# Altium schematic sheet DigitalOut.SchDoc
size A4; SheetNumber: 7; SheetTotal: 8
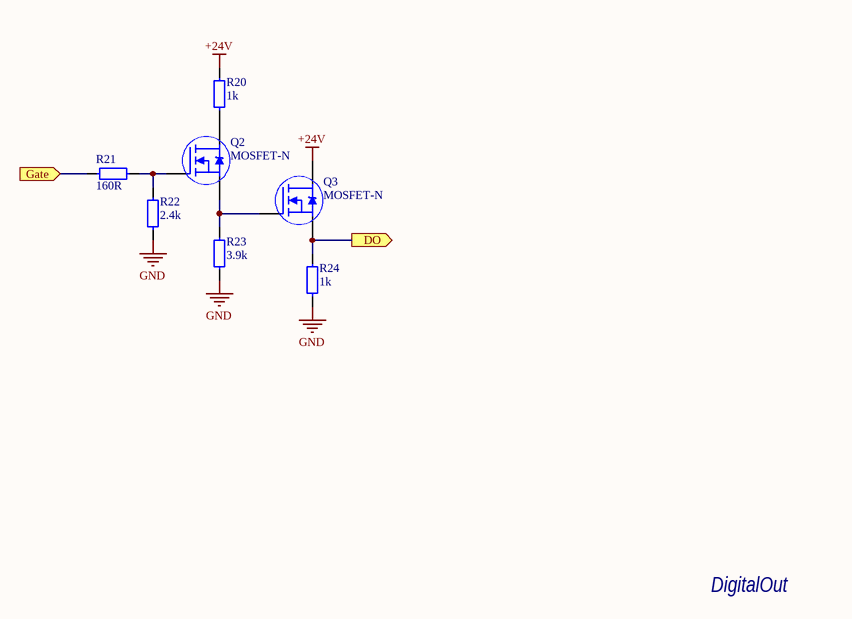
[diagram p0: DigitalOut.SchDoc]

## Parts
Q2  MOSFET-N  [SOT-23]
Q3  MOSFET-N  [SOT-23]
R20  1k  [0603 Resistor]
R21  160R  [0603 Resistor]
R22  2.4k  [0603 Resistor]
R23  3.9k  [0603 Resistor]
R24  1k  [0603 Resistor]

## Ports
DO (out), Gate (in)

## Nets
+24V: Q3.3(Drain) R20.2
GND: R22.1 R23.1 R24.1
DO: Q3.2(Source) R24.2 ; port DO
Gate: R21.1 ; port Gate
NetQ2_1: Q2.1(Gate) R21.2 R22.2
NetQ2_2: Q2.2(Source) Q3.1(Gate) R23.2
NetQ2_3: Q2.3(Drain) R20.1

## Notes on the sheet
- DigitalOut

## Library data of the parts
Q2 Q3 = MOSFET-N [IRLML]: VDS 30V,  VGS Max ± 20V, RDS 27-40mΩ,; Part Number: IRLML0030TRPBF; Manufacturer: Infineon Technologies; Type: Transistor; ComponentLink1Description: DataSheet; ComponentLink1URL: https://static.chipdip.ru/lib/300/DOC000300382.pdf; ComponentLink2Description: Chip&Dip; ComponentLink2URL: https://www.chipdip.ru/product/irlml0030trpbf
R20 R24 = Res 1k (0603): 0.1W 0603 1k, 1%; Part Number: RC0603FR-071KL; Manufacturer: Taiwan; Type: Resistor; ComponentLink1Description: Chip&Dip; ComponentLink1URL: https://www.chipdip.ru/product0/9000079676
R21 = Res 160R (0603): 0.1W 0603 160R, 1%; Part Number: RC0603FR-07160RL; Manufacturer: Taiwan; Type: Resistor; ComponentLink1Description: Chip&Dip; ComponentLink1URL: https://www.chipdip.ru/product/0.1w-0603-160-om-1
R22 = Res 2.4k (0603): 0.1W 0603 2.4k, 1%; Part Number: RC0603FR-072K4L; Manufacturer: Taiwan; Type: Resistor; ComponentLink1Description: Chip&Dip; ComponentLink1URL: https://www.chipdip.ru/product0/9000079721
R23 = Res 3.9k (0603): 0.1W 0603 3.9k, 1%; Part Number: RC0603FR-073K9L; Manufacturer: Taiwan; Type: Resistor; ComponentLink1Description: Chip&Dip; ComponentLink1URL: https://www.chipdip.ru/product0/9000079726